# Altium project LimeSDR-X3_1v2.PrjPcb (part 8 of 20)

## Sheet 16_LMS2_RF2_Misc.SchDoc: LMS2 RF2 Misc
size A3; Organization: Lime Microsystems; Address1: Surrey Tech Centre; Address2: Guildford GU2 7YG; Address3: Surrey; Address4: United Kingdom; Revision: 1.2; SheetNumber: 16; SheetTotal: 31
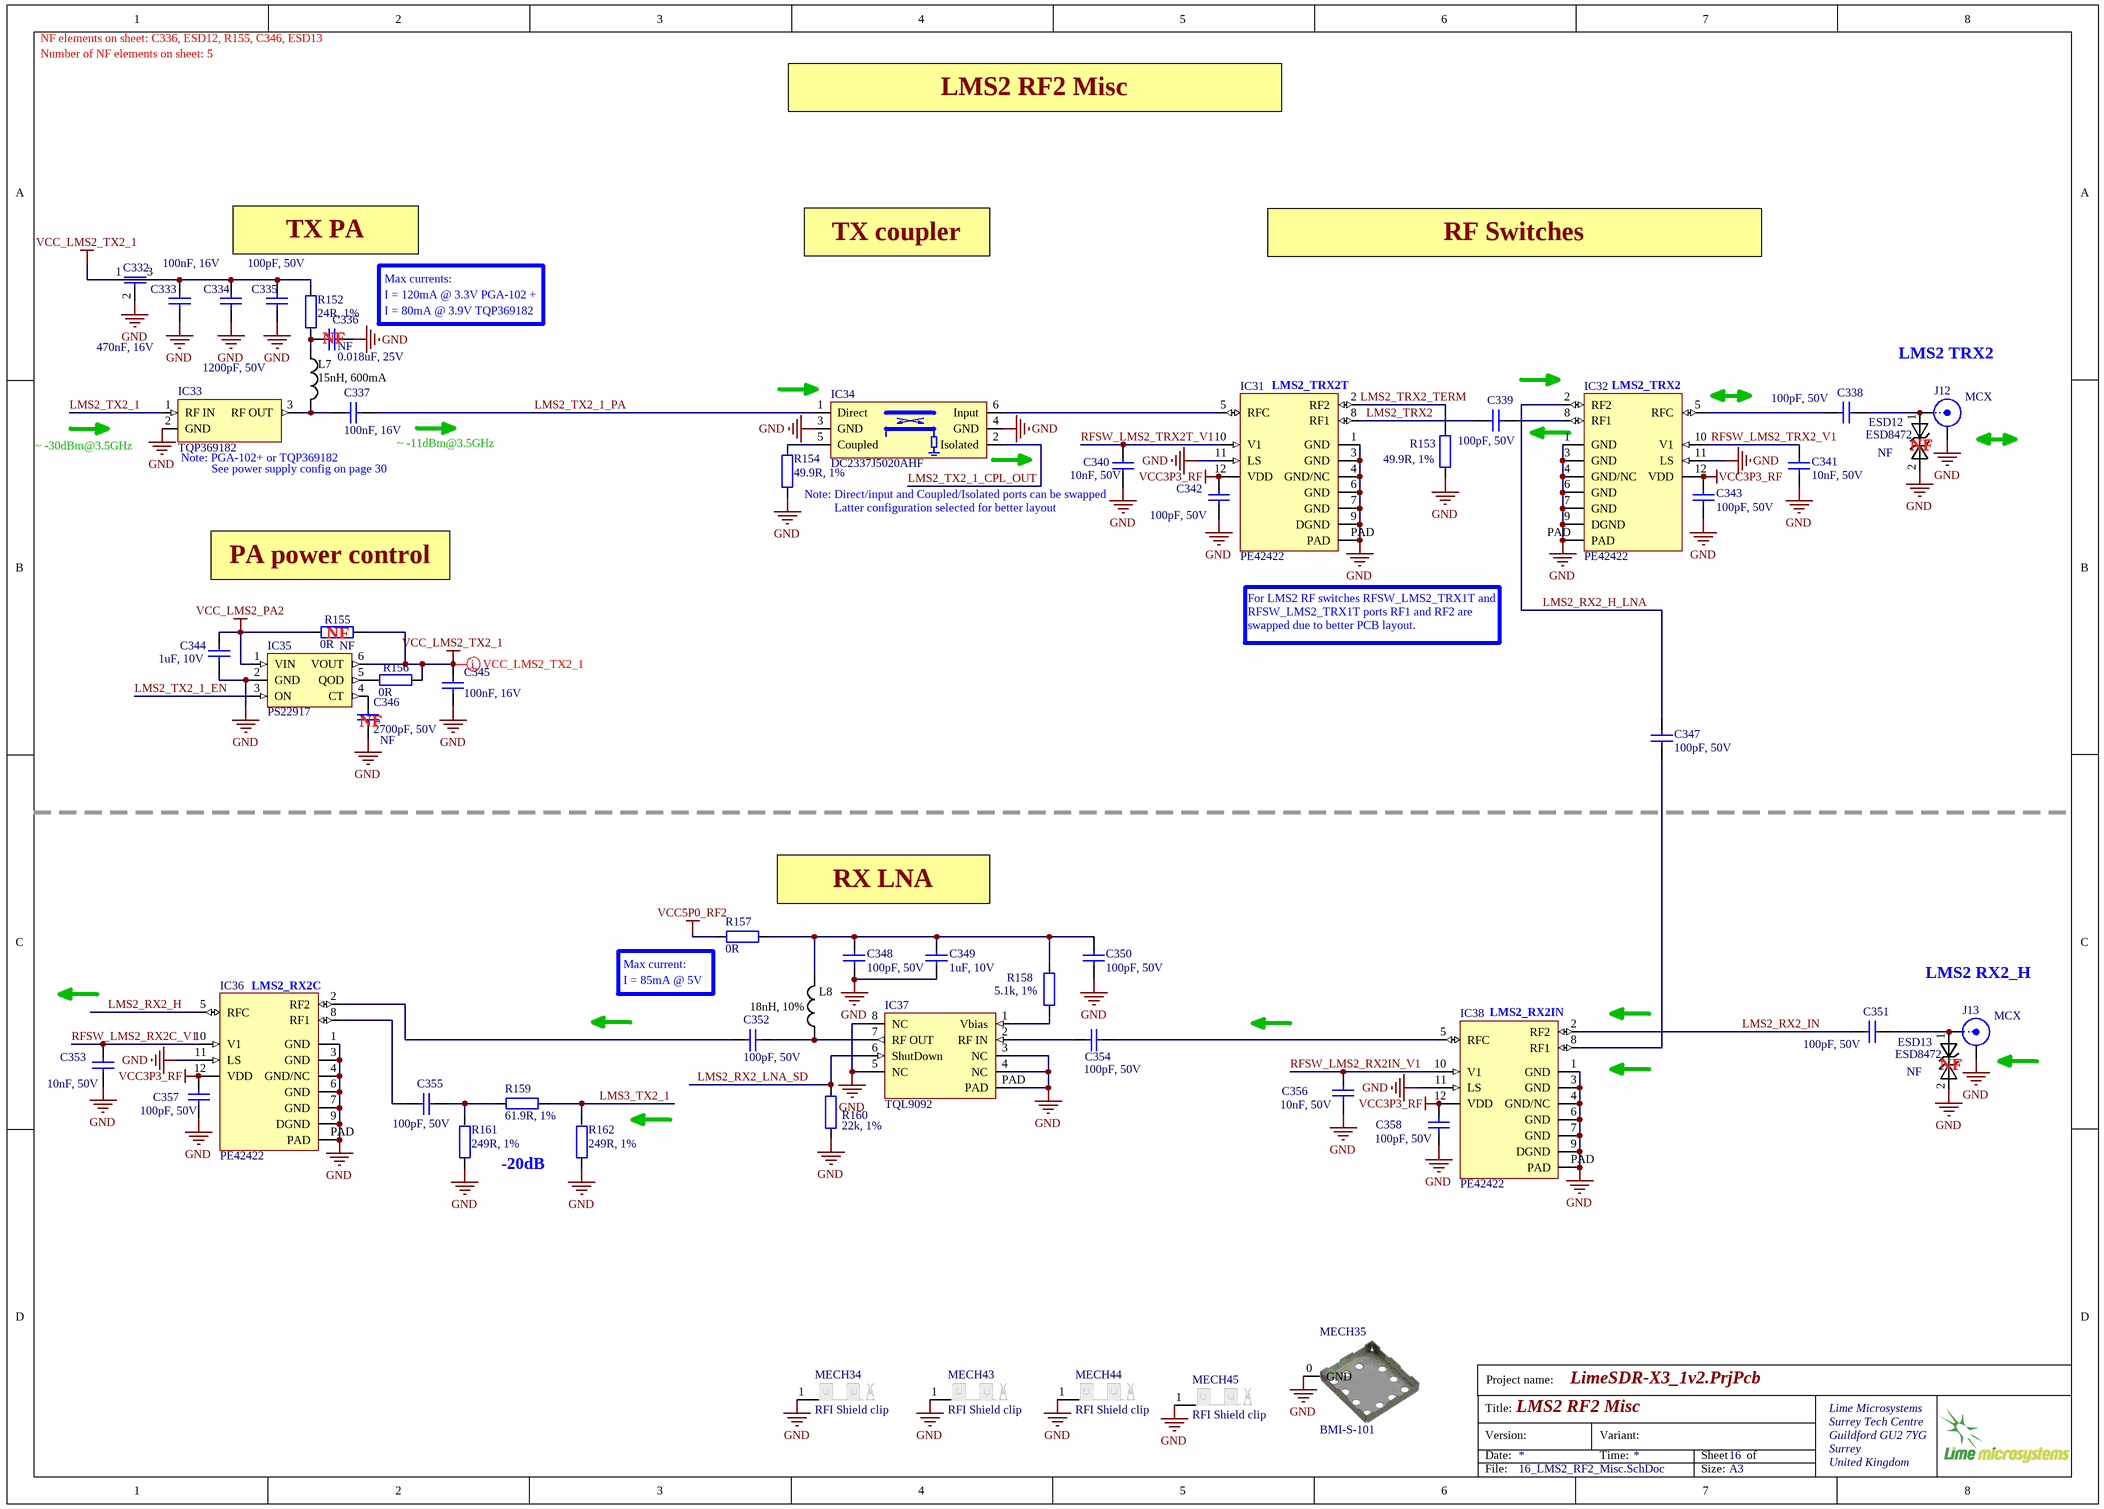
[diagram p15: 16_LMS2_RF2_Misc.SchDoc]

### Parts
C332  470nF, 16V  [CAP0805_FEEDTHROUGH]
C333  100nF, 16V  [CAP0402]
C334  1200pF, 50V  [CAP0402]
C335  100pF, 50V  [CAP0402]
C336  0.018uF, 25V  Assembly Info: NF  [CAP0402]
C337  100nF, 16V  [CAP0402]
C338  100pF, 50V  [CAP0402]
C339  100pF, 50V  [CAP0402]
C340  10nF, 50V  [CAP0402]
C341  10nF, 50V  [CAP0402]
C342  100pF, 50V  [CAP0402]
C343  100pF, 50V  [CAP0402]
C344  1uF, 10V  [CAP0402]
C345  100nF, 16V  [CAP0402]
C346  2700pF, 50V  Assembly Info: NF  [CAP0402]
C347  100pF, 50V  [CAP0402]
C348  100pF, 50V  [CAP0402]
C349  1uF, 10V  [CAP0402]
C350  100pF, 50V  [CAP0402]
C351  100pF, 50V  [CAP0402]
C352  100pF, 50V  [CAP0402]
C353  10nF, 50V  [CAP0402]
C354  100pF, 50V  [CAP0402]
C355  100pF, 50V  [CAP0402]
C356  10nF, 50V  [CAP0402]
C357  100pF, 50V  [CAP0402]
C358  100pF, 50V  [CAP0402]
ESD12  ESD8472  Assembly Info: NF  [ESD8472_X3DFN2]
ESD13  ESD8472  Assembly Info: NF  [ESD8472_X3DFN2]
IC31  PE42422  [PE42422_QFN12]
IC32  PE42422  [PE42422_QFN12]
IC33  TQP369182  [PGA-102+_SOT89]
IC34  DC2337J5020AHF  [DC2337J5020AHF_ANAREN_COUPLER_0805]
IC35  PS22917  [SOT23-6]
IC36  PE42422  [PE42422_QFN12]
IC37  TQL9092  [TQL9092]
IC38  PE42422  [PE42422_QFN12]
J12  MCX  [MCX_connector_vertical_SM]
J13  MCX  [MCX_connector_vertical_SM]
L7  15nH, 600mA  [RES0805]
L8  18nH, 10%  [RES0603]
MECH34  RFI Shield clip  [RFI_SHIELD_CLPS_MINI]
MECH35  BMI-S-101  [BMI-S-101_RF_SHIELD_v2]
MECH43  RFI Shield clip  [RFI_SHIELD_CLPS_MINI]
MECH44  RFI Shield clip  [RFI_SHIELD_CLPS_MINI]
MECH45  RFI Shield clip  [RFI_SHIELD_CLPS_MINI]
R152  24R, 1%  [RES0402]
R153  49.9R, 1%  [RES0402]
R154  49.9R, 1%  [RES0402]
R155  0R  Assembly Info: NF  [RES0402]
R156  0R  [RES0402]
R157  0R  [RES0402]
R158  5.1k, 1%  [RES0603]
R159  61.9R, 1%  [RES0402]
R160  22k, 1%  [RES0402]
R161  249R, 1%  [RES0402]
R162  249R, 1%  [RES0402]

### Nets
GND: C332.2 C333.1 C334.2 C335.2 C336.2 C340.2 C341.2 C342.1 C343.1 C344.1 C345.1 C346.2 C348.2 C349.1 C350.2 C353.2 C356.2 C357.1 C358.1 ESD12.2 ESD13.2 IC31.1(GND) IC31.3(GND) IC31.4(GND/NC) IC31.6(GND) IC31.7(GND) IC31.9(DGND) IC31.11(LS) IC31.PAD IC32.1(GND) IC32.3(GND) IC32.4(GND/NC) IC32.6(GND) IC32.7(GND) IC32.9(DGND) IC32.11(LS) IC32.PAD IC33.2(GND) IC34.3(GND) IC34.4(GND) IC35.2(GND) IC36.1(GND) IC36.3(GND) IC36.4(GND/NC) IC36.6(GND) IC36.7(GND) IC36.9(DGND) IC36.11(LS) IC36.PAD IC37.3(NC) IC37.4(NC) IC37.5(NC) IC37.8(NC) IC37.PAD IC38.1(GND) IC38.3(GND) IC38.4(GND/NC) IC38.6(GND) IC38.7(GND) IC38.9(DGND) IC38.11(LS) IC38.PAD J12.2(Y) J13.2(Y) MECH34.1(GND) MECH35.0(GND) MECH43.1(GND) MECH44.1(GND) MECH45.1(GND) R153.2 R154.2 R160.1 R161.1 R162.1
VCC3P3_RF: C342.2 C343.2 C357.2 C358.2 IC31.12(VDD) IC32.12(VDD) IC36.12(VDD) IC38.12(VDD)
VCC5P0_RF2: R157.1
VCC_LMS2_PA2: C344.2 IC35.1(VIN) R155.2
VCC_LMS2_TX2_1: C332.1 C345.2 IC35.6(VOUT) R155.1 R156.1
LMS2_RX2_H: IC36.5(RFC)
LMS2_RX2_H_LNA: C347.2 IC32.2(RF2)
LMS2_RX2_IN: C351.1 IC38.2(RF2)
LMS2_RX2_LNA_SD: IC37.6(ShutDown) R160.2
LMS2_TRX2: C339.1 IC31.8(RF1)
LMS2_TRX2_TERM: IC31.2(RF2) R153.1
LMS2_TX2_1: IC33.1(RF_IN)
LMS2_TX2_1_CPL_OUT: IC34.2(Isolated)
LMS2_TX2_1_EN: IC35.3(ON)
LMS2_TX2_1_PA: C337.1 IC34.1(Direct)
LMS3_TX2_1: R159.2 R162.2
RFSW_LMS2_RX2C_V1: C353.1 IC36.10(V1)
RFSW_LMS2_RX2IN_V1: C356.1 IC38.10(V1)
RFSW_LMS2_TRX2_V1: C341.1 IC32.10(V1)
RFSW_LMS2_TRX2T_V1: C340.1 IC31.10(V1)
NetC332_3: C332.3 C333.2 C334.1 C335.1 R152.1
NetC336_1: C336.1 L7.1 R152.2
NetC337_2: C337.2 IC33.3(RF_OUT) L7.2
NetC338_1: C338.1 IC32.5(RFC)
NetC338_2: C338.2 ESD12.1 J12.1(X)
NetC339_2: C339.2 IC32.8(RF1)
NetC346_1: C346.1 IC35.4(CT)
NetC347_1: C347.1 IC38.8(RF1)
NetC348_1: C348.1 C349.2 C350.1 L8.1 R157.2 R158.2
NetC351_2: C351.2 ESD13.1 J13.1(X)
NetC352_1: C352.1 IC36.2(RF2)
NetC352_2: C352.2 IC37.7(RF_OUT) L8.2
NetC354_1: C354.1 IC37.2(RF_IN)
NetC354_2: C354.2 IC38.5(RFC)
NetC355_1: C355.1 R159.1 R161.2
NetC355_2: C355.2 IC36.8(RF1)
NetIC31_5: IC31.5(RFC) IC34.6(Input)
NetIC34_5: IC34.5(Coupled) R154.1
NetIC35_5: IC35.5(QOD) R156.2
NetIC37_1: IC37.1(Vbias) R158.1

### Layout directives
net class VCC_LMS2_TX2_2: VCC_LMS2_TX2_1

### Notes on the sheet
- NF elements on sheet: C336, ESD12, R155, C346, ESD13
- Number of NF elements on sheet: 5
- LMS2 RF2 Misc
- TX PA
- (near C332) Ch2
- I = 120mA @ 3.3V PGA-102 +
- Max currents:
- I = 80mA @ 3.9V TQP369182
- TX coupler
- RF Switches
- NF
- LMS2 TRX2
- (near IC33) ~ -30dBm@3.5GHz
- (near C337) ~ -11dBm@3.5GHz
- (near IC31) LMS2_TRX2T
- (near IC32) LMS2_TRX2
- (near ESD12) NF
- (near IC33) Note: PGA-102+ or TQP369182
- See power supply config on page 30
- Note: Direct/input and Coupled/Isolated ports can be swapped
- (near C340) Latter configuration selected for better layout
- PA power control
- (near R155) NF
- (near IC31) For LMS2 RF switches RFSW_LMS2_TRX1T and RFSW_LMS2_TRX1T ports RF1 and RF2 are swapped due to better PCB layout.
- (near C346) NF
- RX LNA
- (near IC36) LMS2_RX2C
- I = 85mA @ 5V
- (near R157) Max current:
- LMS2 RX2_H
- (near IC38) LMS2_RX2IN
- (near ESD13) NF
- -20dB
- Project name:
- Title:
- Version:
- Date:
- Variant:
- Time:
- Sheet
- of
- File:
- Size:
- A3

### Library data of the parts
C332 = Cap_feed_through: as C262 on sheet 14_LMS1_RF_PA; Value: 470nF, 16V; Supplier 1: Digi-Key; Supplier Part Number 1: 490-2537-1-ND; Stock 1: 220606; Pricing 1: 1=0,25000, 10=0,22900, 25=0,21840, 50=0,21160, 100=0,20450, 250=0,19392, 500=0,16218, 1000=0,12586 (USD); Mount: Surface Mount,PCB; Case/Package: 0805; Weight: 0.000194oz; Case Code (Metric): 2012; Case Code (Imperial): 0805; Min Operating Temperature: -55°C; Max Operating Temperature: 125°C; Package Quantity: 1; Capacitance: 470nF; Packaging: Tape and Reel; Max Voltage Rating (DC): 16V; Current Rating: 2A; Voltage Rating: 16V; Voltage Rating (DC): 16V; Voltage: 16V; Current: 2A; Termination: Flat; Length: 2mm; Height: 0.85mm; Width: 1.25mm; Depth: 1.25mm; Radiation Hardening: No; REACH SVHC: No SVHC; Lead Free: Lead Free; RoHS: Yes
C333 C337 C345 = Cap_0402: as C263 on sheet 14_LMS1_RF_PA; Value: 100nF, 16V; Supplier 1: Mouser; Supplier Part Number 1: 81-GRM155R71C104KA88; Case Code - in: 0402; RoHS: RoHS Compliant; Operating Temperature Range: - 55 C to + 125 C; Series: GRM; Termination Style: SMD/SMT; Package / Case: 0402 (1005 metric); Voltage Rating DC: 16 V; Maximum Operating Temperature: + 125 C; Case Code - mm: 1005; Minimum Operating Temperature: - 55 C; Product Category: Low & Medium Capacitance SMD Ceramic Chip Capacitors; Packaging: Reel; Product: General Type MLCCs; Category: Multilayer Ceramic Capacitors MLCC - SMD/SMT; Brand: Murata Electronics; Case Width: 0.5 mm; RoHS - Mouser: Y; Standard Pack Qty: 10000; Minimum Order Quantity: 1; Reeling: True
C334 = Cap_0402: as C306 on sheet 15_LMS2_RF1_Misc; Value: 1200pF, 50V; Supplier 1: Digi-Key; Supplier Part Number 1: 399-7334-1-ND; Thickness (Max): 0.022" (0.55mm); Capacitance: 1200pF; Lead Spacing: -; Mounting Type: Surface Mount, MLCC; Package / Case: 0402 (1005 Metric); Category: Capacitors; Size / Dimension: 0.039" L x 0.020" W (1.00mm x 0.50mm); Voltage - Rated: 50V; Lead Style: -; Ratings: -; Features: -; Packaging: Cut Tape (CT); RoHS: RoHS Compliant; Operating Temperature: -55°C ~ 125°C; Applications: General Purpose; Height - Seated (Max): -
C335 C338 C339 C342 C343 C347 C348 C350-C352 C354 C355 C357 C358 = Cap_0402: as C268 on sheet 14_LMS1_RF_PA; Value: 100pF, 50V; Capacitance: 100pF; Thickness (Max): 0.022" (0.55mm); Size / Dimension: 0.039" L x 0.020" W (1.00mm x 0.50mm); RoHS: RoHS Compliant; Ratings: -; Package / Case: 0402 (1005 Metric); Mounting Type: Surface Mount, MLCC; Height - Seated (Max): -; Features: -; Lead Spacing: -; Voltage - Rated: 50V; Operating Temperature: -55°C ~ 125°C; Packaging: Cut Tape (CT); Applications: General Purpose; Lead Style: -; Supplier 1: Digi-Key; Category: Capacitors; Supplier Part Number 1: 311-1024-1-ND
C336 = Cap_0402: as C309 on sheet 15_LMS2_RF1_Misc; Value: 0.018uF, 25V; ComponentLink1URL: http://www.murata.com/~/media/webrenewal/support/library/catalog/products/capacitor/mlcc/c02e.ashx?la=en-us; ComponentLink1Description: http://www.murata.com/~/media/webrenewal/support/library/catalog/products/capacitor/mlcc/c02e.ashx?la=en-us; Supplier 1: Digi-Key; Supplier Part Number 1: 311-3345-1-ND; Stock 1: 39602; Pricing 1: 1=0,10000, 10=0,05000, 100=0,02210, 500=0,01580, 1000=0,01242, 2500=0,01129, 5000=0,01038 (USD); RoHS: Yes; Mount: Surface Mount; Case/Package: 0402; Min Operating Temperature: -55°C; Max Operating Temperature: 125°C; Packaging: Tape and Reel; Voltage Rating: 25V; Voltage Rating (DC): 25V; Length: 0.039inch; Width: 0.02inch; Thickness: 0.022inch; Lead Free: Lead Free; Halogen Free: Halogen Free; ComponentLink2URL: http://www.yageo.com/documents/recent/UPY-GPHC_X7R_6.3V-to-50V_18.pdf?src-supplier=Digi-Key; ComponentLink2Description: http://www.yageo.com/documents/recent/UPY-GPHC_X7R_6.3V-to-50V_18.pdf?src-supplier=Digi-Key; ComponentLink3URL: http://www.yageo.com/documents/recent/UPY-GPHC_X7R_6.3V-to-50V_16.pdf?src-supplier=Digi-Key; ComponentLink3Description: http://www.yageo.com/documents/recent/UPY-GPHC_X7R_6.3V-to-50V_16.pdf?src-supplier=Digi-Key
C340 C341 C353 C356 = Cap_0402: as C273 on sheet 14_LMS1_RF_PA; Value: 10nF, 50V; Supplier 1: Digi-Key; Supplier Part Number 1: 490-4516-2-ND; RoHS: RoHS Compliant; Category: Capacitors; Stock 1: 10970000; Pricing 1: 10000=0.00185, 20000=0.00176, 30000=0.00167 (USD); Packaging: Tape & Reel (TR); Part Status: Active; Voltage - Rated: 50V; Operating Temperature: -55°C ~ 125°C; Features: -; Ratings: -; Applications: General Purpose; Mounting Type: Surface Mount, MLCC; Package / Case: 0402 (1005 Metric); Size / Dimension: 0.039" L x 0.020" W (1.00mm x 0.50mm); Height - Seated (Max): -; Thickness (Max): 0.022" (0.55mm); Lead Spacing: -; Lead Style: -; ComponentLink1URL: http://www.murata.com/~/media/webrenewal/support/library/catalog/products/capacitor/mlcc/c02e.ashx?la=en-us; ComponentLink1Description: http://www.murata.com/~/media/webrenewal/support/library/catalog/products/capacitor/mlcc/c02e.ashx?la=en-us
C344 C349 = Cap_0402: as C259-C261 on sheet 14_LMS1_RF_PA; Value: 1uF, 10V; Supplier 1: Digi-Key; Supplier Part Number 1: 445-9066-1-ND; MSL: -; RoHS: YES
C346 = Cap_0402: as C267 on sheet 14_LMS1_RF_PA; Value: 2700pF, 50V; Size / Dimension: 0.039" L x 0.020" W (1.00mm x 0.50mm); Supplier 1: Digi-Key; Height - Seated (Max): -; Package / Case: 0402 (1005 Metric); Supplier Part Number 1: 490-6361-1-ND; Part Status: Active; RoHS: RoHS Compliant; Operating Temperature: -55°C ~ 125°C; Category: Capacitors; Ratings: -; Features: -; Packaging: Cut Tape (CT); Mounting Type: Surface Mount, MLCC; Voltage - Rated: 50V; Lead Spacing: -; Thickness (Max): 0.022" (0.55mm); Applications: General Purpose
ESD12 ESD13 = ESD8472: as ESD8 on sheet 14_LMS1_RF_PA; Supplier 1: Digi-Key; RoHS: RoHS Compliant; Category: Circuit Protection; Stock 1: 2295; Pricing 1: 1=0.39, 10=0.315, 100=0.2142, 500=0.16068, 1000=0.12051 (USD); Packaging: Cut Tape (CT); Part Status: Active; Type: Zener; Power - Peak Pulse: -; Applications: Automotive, RF Antenna; Operating Temperature: -55°C ~ 150°C (TJ); Mounting Type: Surface Mount; Package / Case: 2-XFDFN; Supplier Device Package: 2-X3DFN (0.62x0.32); ComponentLink1URL: http://www.onsemi.com/pub/Collateral/ESD8472-D.PDF; ComponentLink1Description: http://www.onsemi.com/pub/Collateral/ESD8472-D.PDF; Supplier Part Number 1: ESD8472MUT5GOSCT-ND
IC31 IC32 IC36 IC38 = PE42422: as IC23 on sheet 15_LMS2_RF1_Misc; Supplier 1: Digi-Key; RoHS: RoHS Compliant; Category: RF/IF and RFID; Stock 1: 21993; Pricing 1: 1=1.32, 101=0.92 (USD); Packaging: Cut Tape (CT); Part Status: Active; P1dB: -; Features: -; Operating Temperature: -40°C ~ 85°C; Package / Case: 12-UFQFN Exposed Pad; Supplier Device Package: 12-QFN (2x2); ComponentLink1URL: http://www.psemi.com/pdf/datasheets/pe42422ds.pdf; ComponentLink1Description: http://www.psemi.com/pdf/datasheets/pe42422ds.pdf; Supplier Part Number 1: 1046-1062-1-ND
IC33 = PGA-102+_PA: as IC25 on sheet 15_LMS2_RF1_Misc; Manufacturer Part Number 1: TQP369182; Supplier Part Number 1: 772-TQP369182; Supplier 1: Mouser
IC34 = DC2337J5020AHF_coupler: as IC26 on sheet 15_LMS2_RF1_Misc; Supplier Part Number 1: 1173-1090-2-ND; Manufacturer Part Number 1: DC2337J5020AHF; Supplier 1: Digi-Key
IC35 = TPS22918: Part Description: Power Switch/Driver 1:1 P-Channel 2A SOT-23-6; Manufacturer: Texas Instruments; Manufacturer Part Number 1: TPS22917DBVR; Number of Channels: 1; Interface: On/Off; Fault Protection: Reverse Current; Output Configuration: High Side; Max Output Current: 2A; ComponentLink1URL: http://www.ti.com/lit/ds/symlink/tps22918.pdf; ComponentLink1Description: http://www.ti.com/lit/ds/symlink/tps22918.pdf; Supplier 1: Digi-Key; Supplier Part Number 1: 296-50498-1-ND; Stock 1: 29778; Pricing 1: 1=0,64, 10=0,545, 25=0,5084, 100=0,4066, 250=0,3776, 500=0,3195, 1000=0,24689 (USD); RoHS: Yes; Case/Package: SOT-23-6; Min Operating Temperature: -40°C; Max Operating Temperature: 125°C; Packaging: Cut Tape; Number of Outputs: 1; Series: -; RoHS Compliant: Yes; ComponentLink2URL: http://www.ti.com/lit/ds/symlink/tps22917.pdf?src-supplier=Digi-Key; ComponentLink2Description: http://www.ti.com/lit/ds/symlink/tps22917.pdf?src-supplier=Digi-Key
IC37 = TQL9092: as IC29 on sheet 15_LMS2_RF1_Misc; Manufacturer Part Number 1: TQL9092; Supplier 1: Mouser; Supplier Part Number 1: 772-TQL9092
J12 J13 = RF_IF_connector: as J8 on sheet 14_LMS1_RF_PA; ComponentLink1URL: https://datasheet.ciiva.com/5177/c908-22101t-37976-5177328.pdf?src-supplier=Mouser; ComponentLink1Description: https://datasheet.ciiva.com/5177/c908-22101t-37976-5177328.pdf?src-supplier=Mouser; ComponentLink2URL: https://datasheet.ciiva.com/643/c908-22101t-643558.pdf?src-supplier=Digi-Key; ComponentLink2Description: https://datasheet.ciiva.com/643/c908-22101t-643558.pdf?src-supplier=Digi-Key; ComponentLink3URL: https://datasheet.ciiva.com/7662/1636995-7662651.pdf?src-supplier=Element14; ComponentLink3Description: https://datasheet.ciiva.com/7662/1636995-7662651.pdf?src-supplier=Element14; ComponentLink4URL: https://datasheet.ciiva.com/5689/c908-22101t-5689787.pdf?src-supplier=Farnell; ComponentLink4Description: https://datasheet.ciiva.com/5689/c908-22101t-5689787.pdf?src-supplier=Farnell; ComponentLink5URL: https://datasheet.ciiva.com/7996/691284-7996807.pdf?src-supplier=Element14; ComponentLink5Description: https://datasheet.ciiva.com/7996/691284-7996807.pdf?src-supplier=Element14; ComponentLink6URL: https://datasheet.ciiva.com/643/c908-22101t-643559.pdf?src-supplier=Digi-Key; ComponentLink6Description: https://datasheet.ciiva.com/643/c908-22101t-643559.pdf?src-supplier=Digi-Key; ComponentLink7URL: https://datasheet.ciiva.com/643/c908-22101t-643560.pdf?src-supplier=Digi-Key; ComponentLink7Description: https://datasheet.ciiva.com/643/c908-22101t-643560.pdf?src-supplier=Digi-Key; Supplier 1: Digikey; Supplier Part Number 1: J548-ND; Stock 1: 6208; Pricing 1: 1=2,86, 10=2,595, 25=2,4576, 50=2,4006, 100=2,2862, 250=2,01248 (USD); RoHS: Yes; Housing Material: 152ConductorMaterial; ComponentLink8URL: https://datasheet.ciiva.com/643/dr-1333711201-643313.pdf?src-supplier=Digikey; ComponentLink8Description: https://datasheet.ciiva.com/643/dr-1333711201-643313.pdf?src-supplier=Digikey; ComponentLink9URL: https://datasheet.ciiva.com/3131/pi-133-3711-201-3131233.pdf?src-supplier=Avnet; ComponentLink9Description: https://datasheet.ciiva.com/3131/pi-133-3711-201-3131233.pdf?src-supplier=Avnet; ComponentLink10URL: https://datasheet.ciiva.com/23817/1720439-23817678.pdf?src-supplier=Newark; ComponentLink10Description: https://datasheet.ciiva.com/23817/1720439-23817678.pdf?src-supplier=Newark; ComponentLink11URL: https://datasheet.ciiva.com/23769/249599-23769434.pdf?src-supplier=Newark; ComponentLink11Description: https://datasheet.ciiva.com/23769/249599-23769434.pdf?src-supplier=Newark; ComponentLink12URL: https://datasheet.ciiva.com/22686/1720437-22686743.pdf?src-supplier=Element14; ComponentLink12Description: https://datasheet.ciiva.com/22686/1720437-22686743.pdf?src-supplier=Element14
L7 = Inductor_0603: as L5 on sheet 15_LMS2_RF1_Misc; Value: 15nH, 600mA; Supplier 1: Digi-Key; Supplier Part Number 1: CW201212-15NJDKR-ND; Stock 1: 2733; Pricing 1: 1=0.37, 10=0.327, 100=0.2245, 500=0.19188, 1000=0.14697 (USD); Mount: Surface Mount; Case/Package: 0805; Weight: 0.000194oz; Case Code (Metric): 2012; Case Code (Imperial): 0805; Min Operating Temperature: -40°C; Max Operating Temperature: 125°C; Package Quantity: 2000; Packaging: Tape and Reel; Current Rating: 600mA; Inductance: 15nH; Max DC Current: 600mA; Termination: SMD/SMT; Composition: Wirewound,Ceramic; DC Current: 600mA; Military Standard: Not; Length: 0.083inch; Height: 0.051inch; Width: 1.5mm; Height - Seated (Max): 0.059inch; Depth: 1.7mm; Radiation Hardening: No; ComponentLink1URL: http://www.bourns.com/data/global/PDFs/CW201212.pdf?src-supplier=Avnet+Europe; ComponentLink1Description: http://www.bourns.com/data/global/PDFs/CW201212.pdf?src-supplier=Avnet+Europe; ComponentLink2URL: http://www.bourns.com/data/global/pdfs/CW201212.pdf?src-supplier=Digi-Key; ComponentLink2Description: http://www.bourns.com/data/global/pdfs/CW201212.pdf?src-supplier=Digi-Key; ComponentLink3URL: http://www.bourns.com/data/global/PDFs/CW201212.pdf?src-supplier=Avnet; ComponentLink3Description: http://www.bourns.com/data/global/PDFs/CW201212.pdf?src-supplier=Avnet; ComponentLink4URL: http://www.onlinecomponents.com/productFiles/mf-BO/cw201212.pdf?src-supplier=Onlinecomponents.com; ComponentLink4Description: http://www.onlinecomponents.com/productFiles/mf-BO/cw201212.pdf?src-supplier=Onlinecomponents.com
L8 = Inductor: as L6 on sheet 15_LMS2_RF1_Misc; Value: 18nH, 10%; Supplier 1: Digi-Key; Supplier Part Number 1: 1840-1105-1-ND; RoHS: RoHS Compliant; Category: Inductors, Coils, Chokes; Stock 1: 14000; Pricing 1: 1=0.41, 10=0.368, 100=0.253, 500=0.2162, 1000=0.1656 (USD); Packaging: Cut Tape (CT); Part Status: Active; Tolerance: ±10%; Ratings: -; Operating Temperature: -40°C ~ 125°C; Mounting Type: Surface Mount; Package / Case: 0603 (1608 Metric); Supplier Device Package: 0603 (1608 Metric); Size / Dimension: 0.071" L x 0.049" W (1.80mm x 1.24mm); Height - Seated (Max): 0.040" (1.02mm); ComponentLink1URL: http://productfinder.pulseeng.com/products/datasheets/WC701.pdf; ComponentLink1Description: http://productfinder.pulseeng.com/products/datasheets/WC701.pdf
MECH34 MECH43-MECH45 = RFI_SHIELD_CLIP: Manufacturer Part Number 1: S0971-46R; Manufacturer: HARWIN; Part Description: RFI SHIELD CLIP MINI TIN SMD; SVHC: No SVHC (15-Jun-2015); Supplier 1: Farnell; Supplier: Farnell; Length: 5.8; Clip Type: RFI Shield Clip; Clip Diameter: -; Product Range: -; Mounting Hole Dia: -; RoHS: YES; Supplier Part Number 1: 2361677
MECH35 = BMI-S-101_RF_SHIELD: Part Description: RF Shield Shield, 1-Piece 0.512" (13.00mm) X 0.538" (13.66mm) Vent Holes in Pattern Surface Mount; Manufacturer: Laird; ComponentLink1URL: http://assets.lairdtech.com/home/brandworld/files/EMI-CAT-Essentials%201213.pdf?src-supplier=Digikey; ComponentLink1Description: http://assets.lairdtech.com/home/brandworld/files/EMI-CAT-Essentials%201213.pdf?src-supplier=Digikey; ComponentLink2URL: http://assets.lairdtech.com/home/brandworld/files/Board%20Level%20Shields%20Catalog%20Download.pdf?src-supplier=Digikey; ComponentLink2Description: http://assets.lairdtech.com/home/brandworld/files/Board%20Level%20Shields%20Catalog%20Download.pdf?src-supplier=Digikey; ComponentLink3URL: https://datasheet.octopart.com/BMI-S-101-Laird-datasheet-150754577.pdf?src-supplier=Sager+Electronics; ComponentLink3Description: https://datasheet.octopart.com/BMI-S-101-Laird-datasheet-150754577.pdf?src-supplier=Sager+Electronics; Supplier 1: Digikey; Supplier Part Number 1: 903-1006-1-ND; Manufacturer Part Number 1: BMI-S-101; Stock 1: 1005; Pricing 1: 1=2,45, 10=1,535, 25=1,2968, 100=1,0281, 250=0,89596, 500=0,8147 (USD); RoHS: Yes
R152 = Res_0402: as R141 on sheet 15_LMS2_RF1_Misc; Value: 24R, 1%; Supplier 1: Digi-Key; Supplier Part Number 1: 13-AC0402FR-0724RLCT-ND; Stock 1: 14420; Pricing 1: 1=0.1, 10=0.022, 100=0.009, 1000=0.00402, 2500=0.00349, 5000=0.00288 (USD); Case/Package: 0402; Min Operating Temperature: -55°C; Max Operating Temperature: 155°C; Packaging: Tape and Reel; Resistance: 24R; Resistor Type: Thick Film; Number of Terminations: 2; Tolerance: 1%; Features: Moisture Resistant,Automotive AEC-Q200; Length: 0.039inch; Width: 0.02inch; Height: 0.015inch; RoHS Compliant: Yes; ComponentLink1URL: http://www.yageo.com/NewPortal/yageodocoutput?fileName=/pdf/R-Chip/PYu-AC_51_RoHS_L_6.pdf&src-supplier=Digi-Key; ComponentLink1Description: http://www.yageo.com/NewPortal/yageodocoutput?fileName=/pdf/R-Chip/PYu-AC_51_RoHS_L_6.pdf&src-supplier=Digi-Key
R153 R154 = Res_0402: as R142 on sheet 15_LMS2_RF1_Misc; Number of Terminations: 2; Size / Dimension: 0.039" L x 0.020" W (1.00mm x 0.50mm); Supplier Device Package: 0402 (1005 Metric); RoHS: RoHS Compliant; Supplier Part Number 1: 1276-3469-6-ND; Features: -; Packaging: Digi-Reel®; Tolerance: ±1%; Height: 0.016" (0.40mm); Category: Resistors; Composition: Thick Film; Package / Case: 0402 (1005 Metric); Supplier 1: Digi-Key; Operating Temperature: -55°C ~ 155°C; Value: 49.9R, 1%; Manufacturer Part Number 1: RC1005F49R9CS
R155-R157 = Res_0402: as R113 on sheet 14_LMS1_RF_PA; Value: 0R; Supplier 1: Digi-Key; Supplier Part Number 1: 311-0.0JRTR-ND; Category: Resistors; Temperature Coefficient: -; Features: Moisture Resistant; Supplier Device Package: 0402; Height: 0.016" (0.40mm); Package / Case: 0402 (1005 Metric); Operating Temperature: -55°C ~ 155°C; Size / Dimension: 0.039" L x 0.020" W (1.00mm x 0.50mm); Composition: Thick Film; Packaging: Tape & Reel (TR); Number of Terminations: 2; RoHS: RoHS Compliant
R158 = Res_0603: as R147 on sheet 15_LMS2_RF1_Misc; Value: 5.1k, 1%; ComponentLink1URL: https://industrial.panasonic.com/cdbs/www-data/pdf/RDA0000/AOA0000C304.pdf; ComponentLink1Description: https://industrial.panasonic.com/cdbs/www-data/pdf/RDA0000/AOA0000C304.pdf; Supplier 1: Digi-Key; Supplier Part Number 1: RMCF0603FT5K10CT-ND; Stock 1: 1507174; Pricing 1: 1=0,10000, 10=0,01500, 100=0,00610, 1000=0,00273, 2500=0,00237 (USD); RoHS: Yes; Mount: Surface Mount; Case/Package: 0603; Case Code (Metric): 1608; Case Code (Imperial): 0603; Contact Plating: Tin,Matte; Min Operating Temperature: -55°C; Max Operating Temperature: 155°C; Tolerance: 1%; Packaging: Tape and Reel; Resistor Type: Thick Film; Number of Terminations: 2; Features: Automotive AEC-Q200; Series: RMCF; Length: 0.061inch; Width: 0.031inch; Height: 0.022inch; Radiation Hardening: No; RoHS Compliant: Yes; ComponentLink2URL: http://components.arrow.com/part/dataview/50863347S9465827N1174?src-supplier=Arrow+Electronics; ComponentLink2Description: http://components.arrow.com/part/dataview/50863347S9465827N1174?src-supplier=Arrow+Electronics; ComponentLink3URL: https://www.seielect.com/catalog/SEI-RMCF_RMCP.pdf?src-supplier=Avnet; ComponentLink3Description: https://www.seielect.com/catalog/SEI-RMCF_RMCP.pdf?src-supplier=Avnet; ComponentLink4URL: https://www.seielect.com/catalog/SEI-Packaging.pdf?src-supplier=Digi-Key; ComponentLink4Description: https://www.seielect.com/catalog/SEI-Packaging.pdf?src-supplier=Digi-Key
R159 = Res_0402: Part Description: 61.9 Ohms ±1% 0.063W, 1/16W Chip Resistor 0402 (1005 Metric) Moisture Resistant Thick Film; Manufacturer: Yageo; Manufacturer Part Number 1: RC0402FR-0761R9L; Power Rating: 62.5mW; Voltage Rating: 50V; Temperature Coefficient: 100ppm/°C; Max Power Dissipation: 63mW; Value: 61.9R, 1%; ComponentLink1URL: https://datasheet.ciiva.com/12577/pyu-rc0402-51-rohs-l-6-r-12577388.pdf?src-supplier=Mouser; ComponentLink1Description: https://datasheet.ciiva.com/12577/pyu-rc0402-51-rohs-l-6-r-12577388.pdf?src-supplier=Mouser; ComponentLink2URL: https://datasheet.ciiva.com/17332/pyu-rc0402-51-rohs-l-6-17332587.pdf?src-supplier=Future+Electronics; ComponentLink2Description: https://datasheet.ciiva.com/17332/pyu-rc0402-51-rohs-l-6-17332587.pdf?src-supplier=Future+Electronics; Supplier 1: Digi-Key; Supplier Part Number 1: 311-61.9LRCT-ND; Stock 1: 93771; Pricing 1: 1=0,10000, 10=0,01600, 100=0,00660, 1000=0,00299, 2500=0,00259, 5000=0,00214 (USD); RoHS: Yes; Case/Package: 0402; Case Code (Imperial): 0402; Case Code (Metric): 1005; Contact Plating: Tin,Matte,Lead; Min Operating Temperature: -55°C; Max Operating Temperature: 155°C; Package Quantity: 1; Resistance: 61.9R; Tolerance: 1%; Packaging: Tape and Reel; Termination: SMD/SMT; Resistor Type: Thick Film; Number of Terminations: 2; Voltage Rating (DC): 50V; Working Voltage: 50V; Features: Moisture Resistant; Series: RC; Construction: Rectangular; Technology: THICK FILM; Length: 1mm; Width: 0.5mm; Height: 0.016inch; Depth: 0.5mm; Radiation Hardening: No; Military Standard: Not; Lead Free: Lead Free; RoHS Compliant: Yes; ComponentLink3URL: https://datasheet.ciiva.com/2453/pyu-r-int-thick-7-2453707.pdf?src-supplier=Digi-Key; ComponentLink3Description: https://datasheet.ciiva.com/2453/pyu-r-int-thick-7-2453707.pdf?src-supplier=Digi-Key; ComponentLink4URL: https://datasheet.ciiva.com/2453/pyu-r-int-thick-7-2453708.pdf?src-supplier=Digi-Key; ComponentLink4Description: https://datasheet.ciiva.com/2453/pyu-r-int-thick-7-2453708.pdf?src-supplier=Digi-Key; ComponentLink5URL: https://datasheet.ciiva.com/2453/pyu-r-int-thick-7-2453706.pdf?src-supplier=Digi-Key; ComponentLink5Description: https://datasheet.ciiva.com/2453/pyu-r-int-thick-7-2453706.pdf?src-supplier=Digi-Key; ComponentLink6URL: https://datasheet.ciiva.com/8888/pyu-rc0402-51-rohs-l-6-8888591.pdf?src-supplier=Avnet; ComponentLink6Description: https://datasheet.ciiva.com/8888/pyu-rc0402-51-rohs-l-6-8888591.pdf?src-supplier=Avnet; ComponentLink7URL: https://datasheet.ciiva.com/16741/pyu-rc0402-51-rohs-l-6-r-16741941.pdf?src-supplier=Future+Electronics; ComponentLink7Description: https://datasheet.ciiva.com/16741/pyu-rc0402-51-rohs-l-6-r-16741941.pdf?src-supplier=Future+Electronics; ComponentLink8URL: https://datasheet.ciiva.com/15189/getdatasheetpartid-325045-15189495.pdf?src-supplier=Verical; ComponentLink8Description: https://datasheet.ciiva.com/15189/getdatasheetpartid-325045-15189495.pdf?src-supplier=Verical
R160 = Res_0402: as R149 on sheet 15_LMS2_RF1_Misc; Value: 22k, 1%; Number of Terminations: 2; Operating Temperature: -55°C ~ 155°C; Package / Case: 0402 (1005 Metric); Category: Resistors; Size / Dimension: 0.039" L x 0.020" W (1.00mm x 0.50mm); Height: 0.016" (0.40mm); Supplier 1: Digi-Key; Supplier Part Number 1: 311-22.0KLRCT-ND; RoHS: RoHS Compliant; Features: Moisture Resistant; Packaging: Cut Tape (CT); Composition: Thick Film; Supplier Device Package: 0402; Resistance (Ohms): 22k; Tolerance: ±1%
R161 R162 = Res_0402: as R150 on sheet 15_LMS2_RF1_Misc; Value: 249R, 1%; Category: Resistors; Composition: Thick Film; Features: -; Height: 0.016" (0.40mm); Number of Terminations: 2; Operating Temperature: -55°C ~ 155°C; Package / Case: 0402 (1005 Metric); Packaging: Cut Tape (CT); RoHS: RoHS Compliant; Size / Dimension: 0.039" L x 0.020" W (1.00mm x 0.50mm); Supplier 1: Digi-Key; Supplier Device Package: 0402; Supplier Part Number 1: RMCF0402FT249RCT-ND; Tolerance: ±1%

## Sheet 17_FPGA_B12_B13_B14_B15.SchDoc: FPGA Banks 12, 13, 14, 15
size A3; Organization: Lime Microsystems; Address1: Surrey Tech Centre; Address2: Guildford GU2 7YG; Address3: Surrey; Address4: United Kingdom; Revision: 1.2; SheetNumber: 17; SheetTotal: 31
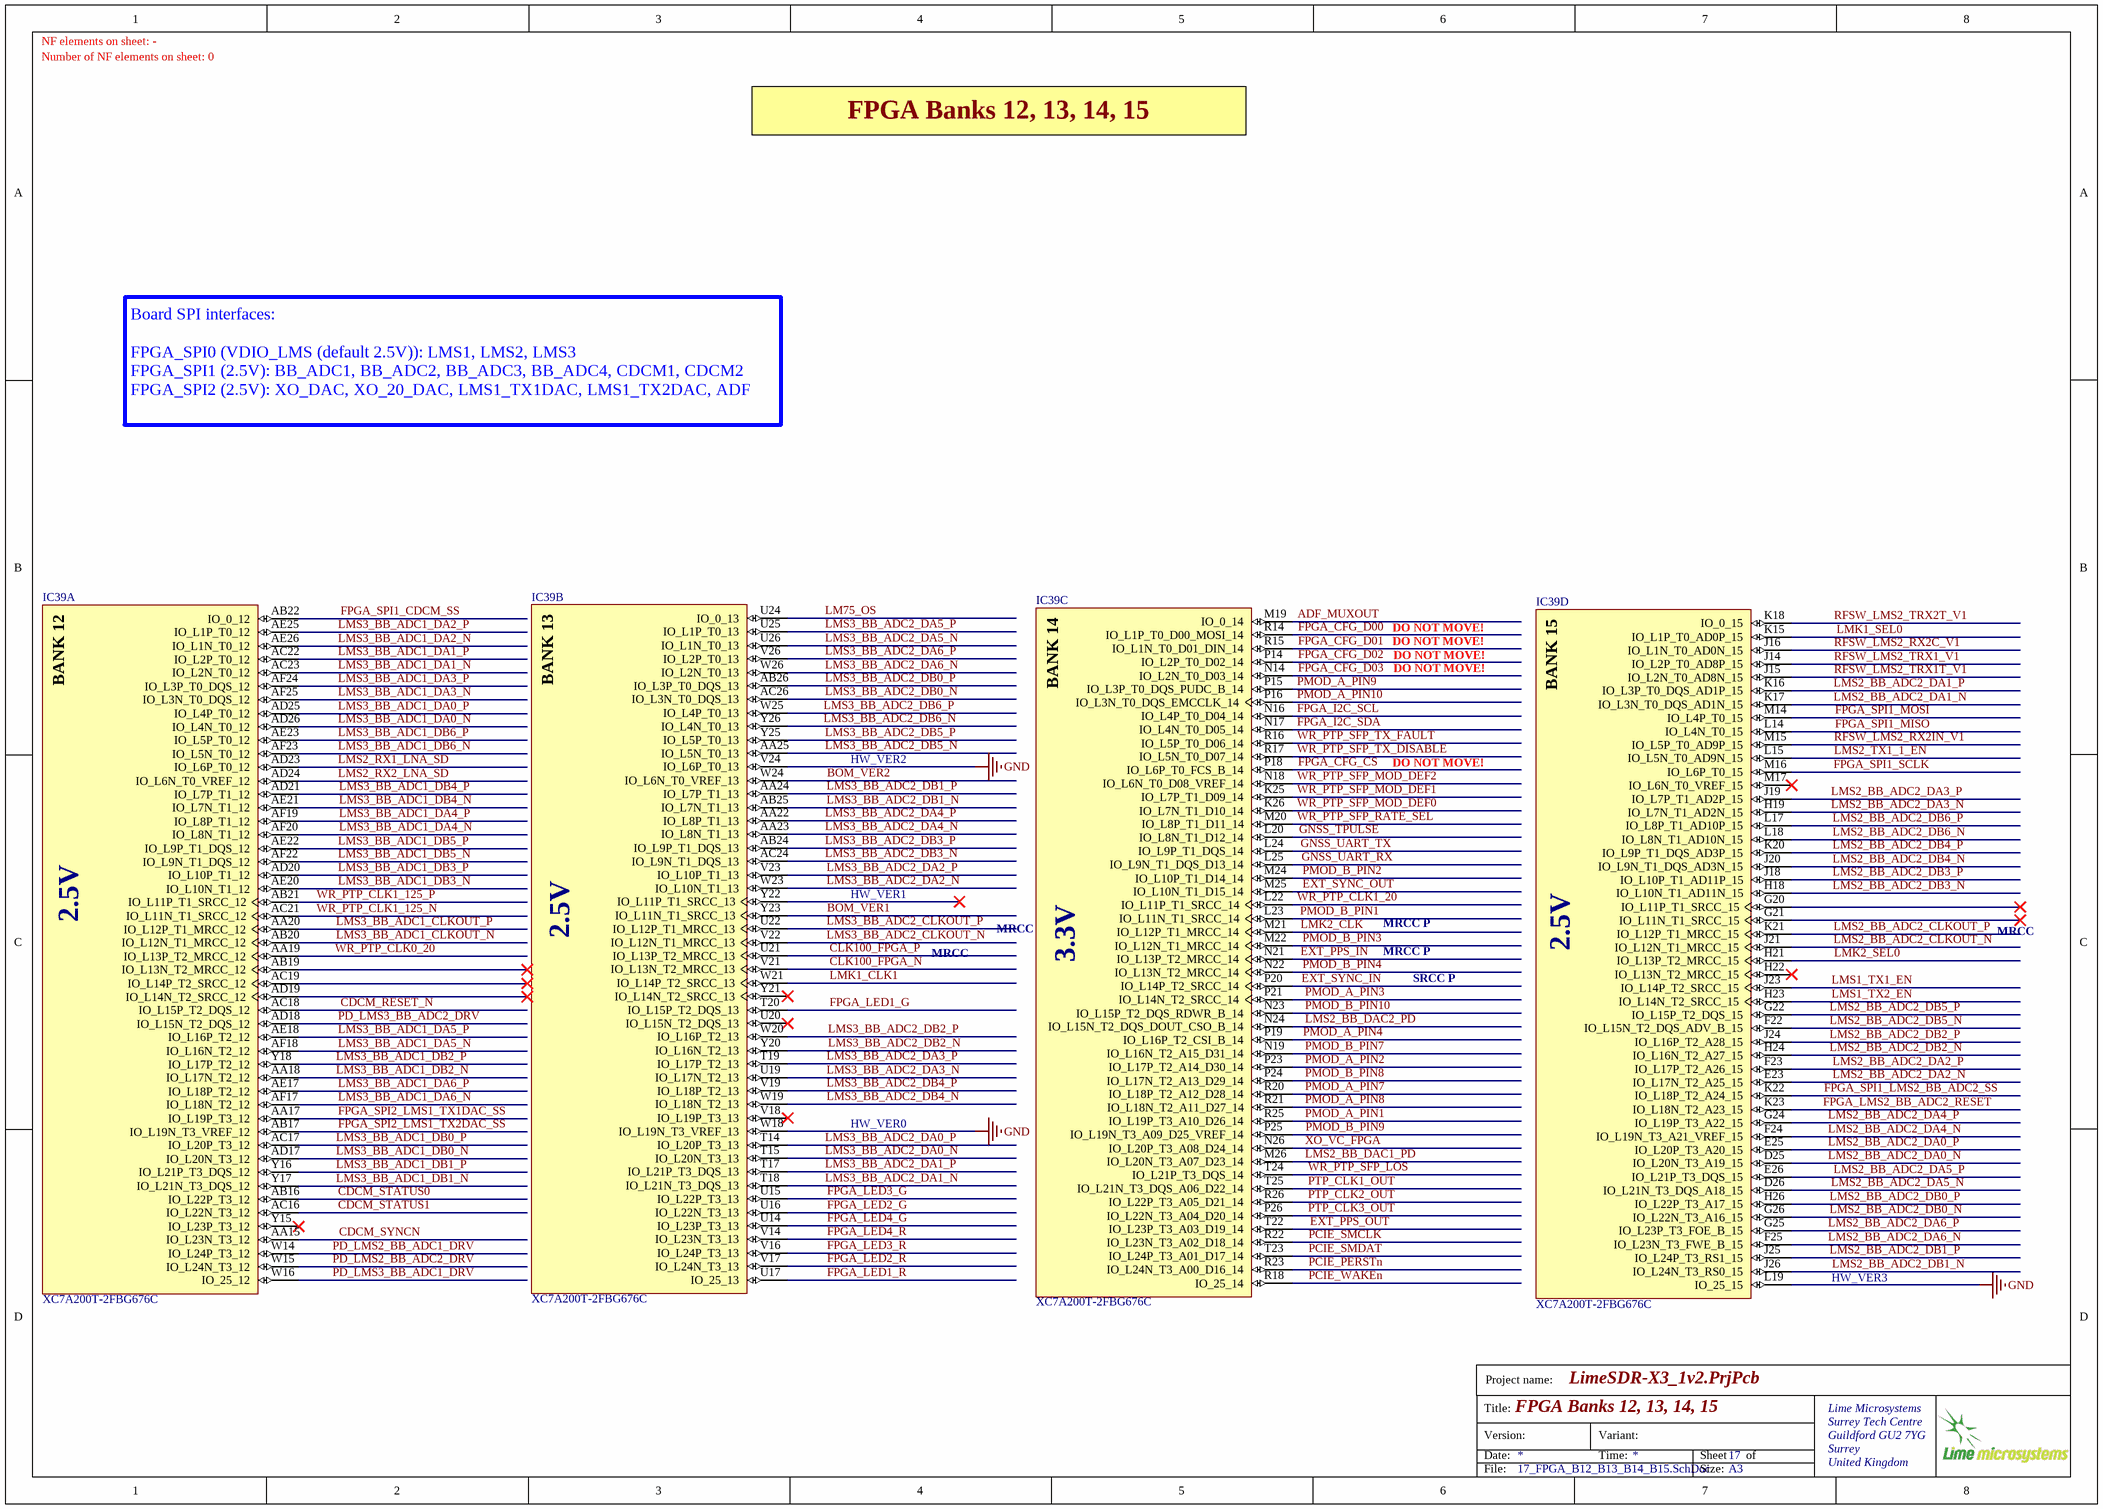
[diagram p16: 17_FPGA_B12_B13_B14_B15.SchDoc]

### Parts
IC39  XC7A200T-2FBG676C  [XC7A200T-2FBG676C_FBG676]  (parts A,B,C,D of 14)

### Nets
GND: IC39.L19(IO_25_15) IC39.V24(IO_L6P_T0_13) IC39.W18(IO_L19N_T3_VREF_13)
ADF_MUXOUT: IC39.M19(IO_0_14)
BOM_VER1: IC39.Y23(IO_L11N_T1_SRCC_13)
BOM_VER2: IC39.W24(IO_L6N_T0_VREF_13)
CDCM_RESET_N: IC39.AC18(IO_L15P_T2_DQS_12)
CDCM_STATUS0: IC39.AB16(IO_L22P_T3_12)
CDCM_STATUS1: IC39.AC16(IO_L22N_T3_12)
CDCM_SYNCN: IC39.AA15(IO_L23N_T3_12)
CLK100_FPGA_N: IC39.V21(IO_L13N_T2_MRCC_13)
CLK100_FPGA_P: IC39.U21(IO_L13P_T2_MRCC_13)
EXT_PPS_IN: IC39.N21(IO_L13P_T2_MRCC_14)
EXT_PPS_OUT: IC39.T22(IO_L23P_T3_A03_D19_14)
EXT_SYNC_IN: IC39.P20(IO_L14P_T2_SRCC_14)
EXT_SYNC_OUT: IC39.M25(IO_L10N_T1_D15_14)
FPGA_CFG_CS: IC39.P18(IO_L6P_T0_FCS_B_14)
FPGA_CFG_D00: IC39.R14(IO_L1P_T0_D00_MOSI_14)
FPGA_CFG_D01: IC39.R15(IO_L1N_T0_D01_DIN_14)
FPGA_CFG_D02: IC39.P14(IO_L2P_T0_D02_14)
FPGA_CFG_D03: IC39.N14(IO_L2N_T0_D03_14)
FPGA_I2C_SCL: IC39.N16(IO_L4P_T0_D04_14)
FPGA_I2C_SDA: IC39.N17(IO_L4N_T0_D05_14)
FPGA_LED1_G: IC39.T20(IO_L15P_T2_DQS_13)
FPGA_LED1_R: IC39.U17(IO_25_13)
FPGA_LED2_G: IC39.U16(IO_L22N_T3_13)
FPGA_LED2_R: IC39.V17(IO_L24N_T3_13)
FPGA_LED3_G: IC39.U15(IO_L22P_T3_13)
FPGA_LED3_R: IC39.V16(IO_L24P_T3_13)
FPGA_LED4_G: IC39.U14(IO_L23P_T3_13)
FPGA_LED4_R: IC39.V14(IO_L23N_T3_13)
FPGA_LMS2_BB_ADC2_RESET: IC39.K23(IO_L18N_T2_A23_15)
FPGA_SPI1_CDCM_SS: IC39.AB22(IO_0_12)
FPGA_SPI1_LMS2_BB_ADC2_SS: IC39.K22(IO_L18P_T2_A24_15)
FPGA_SPI1_MISO: IC39.L14(IO_L4N_T0_15)
FPGA_SPI1_MOSI: IC39.M14(IO_L4P_T0_15)
FPGA_SPI1_SCLK: IC39.M16(IO_L6P_T0_15)
FPGA_SPI2_LMS1_TX1DAC_SS: IC39.AA17(IO_L19P_T3_12)
FPGA_SPI2_LMS1_TX2DAC_SS: IC39.AB17(IO_L19N_T3_VREF_12)
GNSS_TPULSE: IC39.L20(IO_L8N_T1_D12_14)
GNSS_UART_RX: IC39.L25(IO_L9N_T1_DQS_D13_14)
GNSS_UART_TX: IC39.L24(IO_L9P_T1_DQS_14)
LM75_OS: IC39.U24(IO_0_13)
LMK1_CLK1: IC39.W21(IO_L14P_T2_SRCC_13)
LMK1_SEL0: IC39.K15(IO_L1P_T0_AD0P_15)
LMK2_CLK: IC39.M21(IO_L12P_T1_MRCC_14)
LMK2_SEL0: IC39.H21(IO_L13P_T2_MRCC_15)
LMS1_TX1_EN: IC39.J23(IO_L14P_T2_SRCC_15)
LMS1_TX2_EN: IC39.H23(IO_L14N_T2_SRCC_15)
LMS2_BB_ADC2_CLKOUT_N: IC39.J21(IO_L12N_T1_MRCC_15)
LMS2_BB_ADC2_CLKOUT_P: IC39.K21(IO_L12P_T1_MRCC_15)
LMS2_BB_ADC2_DA0_N: IC39.D25(IO_L20N_T3_A19_15)
LMS2_BB_ADC2_DA0_P: IC39.E25(IO_L20P_T3_A20_15)
LMS2_BB_ADC2_DA1_N: IC39.K17(IO_L3N_T0_DQS_AD1N_15)
LMS2_BB_ADC2_DA1_P: IC39.K16(IO_L3P_T0_DQS_AD1P_15)
LMS2_BB_ADC2_DA2_N: IC39.E23(IO_L17N_T2_A25_15)
LMS2_BB_ADC2_DA2_P: IC39.F23(IO_L17P_T2_A26_15)
LMS2_BB_ADC2_DA3_N: IC39.H19(IO_L7N_T1_AD2N_15)
LMS2_BB_ADC2_DA3_P: IC39.J19(IO_L7P_T1_AD2P_15)
LMS2_BB_ADC2_DA4_N: IC39.F24(IO_L19N_T3_A21_VREF_15)
LMS2_BB_ADC2_DA4_P: IC39.G24(IO_L19P_T3_A22_15)
LMS2_BB_ADC2_DA5_N: IC39.D26(IO_L21N_T3_DQS_A18_15)
LMS2_BB_ADC2_DA5_P: IC39.E26(IO_L21P_T3_DQS_15)
LMS2_BB_ADC2_DA6_N: IC39.F25(IO_L23N_T3_FWE_B_15)
LMS2_BB_ADC2_DA6_P: IC39.G25(IO_L23P_T3_FOE_B_15)
LMS2_BB_ADC2_DB0_N: IC39.G26(IO_L22N_T3_A16_15)
LMS2_BB_ADC2_DB0_P: IC39.H26(IO_L22P_T3_A17_15)
LMS2_BB_ADC2_DB1_N: IC39.J26(IO_L24N_T3_RS0_15)
LMS2_BB_ADC2_DB1_P: IC39.J25(IO_L24P_T3_RS1_15)
LMS2_BB_ADC2_DB2_N: IC39.H24(IO_L16N_T2_A27_15)
LMS2_BB_ADC2_DB2_P: IC39.J24(IO_L16P_T2_A28_15)
LMS2_BB_ADC2_DB3_N: IC39.H18(IO_L10N_T1_AD11N_15)
LMS2_BB_ADC2_DB3_P: IC39.J18(IO_L10P_T1_AD11P_15)
LMS2_BB_ADC2_DB4_N: IC39.J20(IO_L9N_T1_DQS_AD3N_15)
LMS2_BB_ADC2_DB4_P: IC39.K20(IO_L9P_T1_DQS_AD3P_15)
LMS2_BB_ADC2_DB5_N: IC39.F22(IO_L15N_T2_DQS_ADV_B_15)
LMS2_BB_ADC2_DB5_P: IC39.G22(IO_L15P_T2_DQS_15)
LMS2_BB_ADC2_DB6_N: IC39.L18(IO_L8N_T1_AD10N_15)
LMS2_BB_ADC2_DB6_P: IC39.L17(IO_L8P_T1_AD10P_15)
LMS2_BB_DAC1_PD: IC39.M26(IO_L20N_T3_A07_D23_14)
LMS2_BB_DAC2_PD: IC39.N24(IO_L15N_T2_DQS_DOUT_CSO_B_14)
LMS2_RX1_LNA_SD: IC39.AD23(IO_L6P_T0_12)
LMS2_RX2_LNA_SD: IC39.AD24(IO_L6N_T0_VREF_12)
LMS2_TX1_1_EN: IC39.L15(IO_L5N_T0_AD9N_15)
LMS3_BB_ADC1_CLKOUT_N: IC39.AB20(IO_L12N_T1_MRCC_12)
LMS3_BB_ADC1_CLKOUT_P: IC39.AA20(IO_L12P_T1_MRCC_12)
LMS3_BB_ADC1_DA0_N: IC39.AD26(IO_L4N_T0_12)
LMS3_BB_ADC1_DA0_P: IC39.AD25(IO_L4P_T0_12)
LMS3_BB_ADC1_DA1_N: IC39.AC23(IO_L2N_T0_12)
LMS3_BB_ADC1_DA1_P: IC39.AC22(IO_L2P_T0_12)
LMS3_BB_ADC1_DA2_N: IC39.AE26(IO_L1N_T0_12)
LMS3_BB_ADC1_DA2_P: IC39.AE25(IO_L1P_T0_12)
LMS3_BB_ADC1_DA3_N: IC39.AF25(IO_L3N_T0_DQS_12)
LMS3_BB_ADC1_DA3_P: IC39.AF24(IO_L3P_T0_DQS_12)
LMS3_BB_ADC1_DA4_N: IC39.AF20(IO_L8N_T1_12)
LMS3_BB_ADC1_DA4_P: IC39.AF19(IO_L8P_T1_12)
LMS3_BB_ADC1_DA5_N: IC39.AF18(IO_L16N_T2_12)
LMS3_BB_ADC1_DA5_P: IC39.AE18(IO_L16P_T2_12)
LMS3_BB_ADC1_DA6_N: IC39.AF17(IO_L18N_T2_12)
LMS3_BB_ADC1_DA6_P: IC39.AE17(IO_L18P_T2_12)
LMS3_BB_ADC1_DB0_N: IC39.AD17(IO_L20N_T3_12)
LMS3_BB_ADC1_DB0_P: IC39.AC17(IO_L20P_T3_12)
LMS3_BB_ADC1_DB1_N: IC39.Y17(IO_L21N_T3_DQS_12)
LMS3_BB_ADC1_DB1_P: IC39.Y16(IO_L21P_T3_DQS_12)
LMS3_BB_ADC1_DB2_N: IC39.AA18(IO_L17N_T2_12)
LMS3_BB_ADC1_DB2_P: IC39.Y18(IO_L17P_T2_12)
LMS3_BB_ADC1_DB3_N: IC39.AE20(IO_L10N_T1_12)
LMS3_BB_ADC1_DB3_P: IC39.AD20(IO_L10P_T1_12)
LMS3_BB_ADC1_DB4_N: IC39.AE21(IO_L7N_T1_12)
LMS3_BB_ADC1_DB4_P: IC39.AD21(IO_L7P_T1_12)
LMS3_BB_ADC1_DB5_N: IC39.AF22(IO_L9N_T1_DQS_12)
LMS3_BB_ADC1_DB5_P: IC39.AE22(IO_L9P_T1_DQS_12)
LMS3_BB_ADC1_DB6_N: IC39.AF23(IO_L5N_T0_12)
LMS3_BB_ADC1_DB6_P: IC39.AE23(IO_L5P_T0_12)
LMS3_BB_ADC2_CLKOUT_N: IC39.V22(IO_L12N_T1_MRCC_13)
LMS3_BB_ADC2_CLKOUT_P: IC39.U22(IO_L12P_T1_MRCC_13)
LMS3_BB_ADC2_DA0_N: IC39.T15(IO_L20N_T3_13)
LMS3_BB_ADC2_DA0_P: IC39.T14(IO_L20P_T3_13)
LMS3_BB_ADC2_DA1_N: IC39.T18(IO_L21N_T3_DQS_13)
LMS3_BB_ADC2_DA1_P: IC39.T17(IO_L21P_T3_DQS_13)
LMS3_BB_ADC2_DA2_N: IC39.W23(IO_L10N_T1_13)
LMS3_BB_ADC2_DA2_P: IC39.V23(IO_L10P_T1_13)
LMS3_BB_ADC2_DA3_N: IC39.U19(IO_L17N_T2_13)
LMS3_BB_ADC2_DA3_P: IC39.T19(IO_L17P_T2_13)
LMS3_BB_ADC2_DA4_N: IC39.AA23(IO_L8N_T1_13)
LMS3_BB_ADC2_DA4_P: IC39.AA22(IO_L8P_T1_13)
LMS3_BB_ADC2_DA5_N: IC39.U26(IO_L1N_T0_13)
LMS3_BB_ADC2_DA5_P: IC39.U25(IO_L1P_T0_13)
LMS3_BB_ADC2_DA6_N: IC39.W26(IO_L2N_T0_13)
LMS3_BB_ADC2_DA6_P: IC39.V26(IO_L2P_T0_13)
LMS3_BB_ADC2_DB0_N: IC39.AC26(IO_L3N_T0_DQS_13)
LMS3_BB_ADC2_DB0_P: IC39.AB26(IO_L3P_T0_DQS_13)
LMS3_BB_ADC2_DB1_N: IC39.AB25(IO_L7N_T1_13)
LMS3_BB_ADC2_DB1_P: IC39.AA24(IO_L7P_T1_13)
LMS3_BB_ADC2_DB2_N: IC39.Y20(IO_L16N_T2_13)
LMS3_BB_ADC2_DB2_P: IC39.W20(IO_L16P_T2_13)
LMS3_BB_ADC2_DB3_N: IC39.AC24(IO_L9N_T1_DQS_13)
LMS3_BB_ADC2_DB3_P: IC39.AB24(IO_L9P_T1_DQS_13)
LMS3_BB_ADC2_DB4_N: IC39.W19(IO_L18N_T2_13)
LMS3_BB_ADC2_DB4_P: IC39.V19(IO_L18P_T2_13)
LMS3_BB_ADC2_DB5_N: IC39.AA25(IO_L5N_T0_13)
LMS3_BB_ADC2_DB5_P: IC39.Y25(IO_L5P_T0_13)
LMS3_BB_ADC2_DB6_N: IC39.Y26(IO_L4N_T0_13)
LMS3_BB_ADC2_DB6_P: IC39.W25(IO_L4P_T0_13)
PCIE_PERSTn: IC39.R23(IO_L24N_T3_A00_D16_14)
PCIE_SMCLK: IC39.R22(IO_L23N_T3_A02_D18_14)
PCIE_SMDAT: IC39.T23(IO_L24P_T3_A01_D17_14)
PCIE_WAKEn: IC39.R18(IO_25_14)
PD_LMS2_BB_ADC1_DRV: IC39.W14(IO_L24P_T3_12)
PD_LMS2_BB_ADC2_DRV: IC39.W15(IO_L24N_T3_12)
PD_LMS3_BB_ADC1_DRV: IC39.W16(IO_25_12)
PD_LMS3_BB_ADC2_DRV: IC39.AD18(IO_L15N_T2_DQS_12)
PMOD_A_PIN1: IC39.R25(IO_L19P_T3_A10_D26_14)
PMOD_A_PIN2: IC39.P23(IO_L17P_T2_A14_D30_14)
PMOD_A_PIN3: IC39.P21(IO_L14N_T2_SRCC_14)
PMOD_A_PIN4: IC39.P19(IO_L16P_T2_CSI_B_14)
PMOD_A_PIN7: IC39.R20(IO_L18P_T2_A12_D28_14)
PMOD_A_PIN8: IC39.R21(IO_L18N_T2_A11_D27_14)
PMOD_A_PIN9: IC39.P15(IO_L3P_T0_DQS_PUDC_B_14)
PMOD_A_PIN10: IC39.P16(IO_L3N_T0_DQS_EMCCLK_14)
PMOD_B_PIN1: IC39.L23(IO_L11N_T1_SRCC_14)
PMOD_B_PIN2: IC39.M24(IO_L10P_T1_D14_14)
PMOD_B_PIN3: IC39.M22(IO_L12N_T1_MRCC_14)
PMOD_B_PIN4: IC39.N22(IO_L13N_T2_MRCC_14)
PMOD_B_PIN7: IC39.N19(IO_L16N_T2_A15_D31_14)
PMOD_B_PIN8: IC39.P24(IO_L17N_T2_A13_D29_14)
PMOD_B_PIN9: IC39.P25(IO_L19N_T3_A09_D25_VREF_14)
PMOD_B_PIN10: IC39.N23(IO_L15P_T2_DQS_RDWR_B_14)
PTP_CLK1_OUT: IC39.T25(IO_L21N_T3_DQS_A06_D22_14)
PTP_CLK2_OUT: IC39.R26(IO_L22P_T3_A05_D21_14)
PTP_CLK3_OUT: IC39.P26(IO_L22N_T3_A04_D20_14)
RFSW_LMS2_RX2C_V1: IC39.J16(IO_L1N_T0_AD0N_15)
RFSW_LMS2_RX2IN_V1: IC39.M15(IO_L5P_T0_AD9P_15)
RFSW_LMS2_TRX1_V1: IC39.J14(IO_L2P_T0_AD8P_15)
RFSW_LMS2_TRX1T_V1: IC39.J15(IO_L2N_T0_AD8N_15)
RFSW_LMS2_TRX2T_V1: IC39.K18(IO_0_15)
WR_PTP_CLK0_20: IC39.AA19(IO_L13P_T2_MRCC_12)
WR_PTP_CLK1_20: IC39.L22(IO_L11P_T1_SRCC_14)
WR_PTP_CLK1_125_N: IC39.AC21(IO_L11N_T1_SRCC_12)
WR_PTP_CLK1_125_P: IC39.AB21(IO_L11P_T1_SRCC_12)
WR_PTP_SFP_LOS: IC39.T24(IO_L21P_T3_DQS_14)
WR_PTP_SFP_MOD_DEF0: IC39.K26(IO_L7N_T1_D10_14)
WR_PTP_SFP_MOD_DEF1: IC39.K25(IO_L7P_T1_D09_14)
WR_PTP_SFP_MOD_DEF2: IC39.N18(IO_L6N_T0_D08_VREF_14)
WR_PTP_SFP_RATE_SEL: IC39.M20(IO_L8P_T1_D11_14)
WR_PTP_SFP_TX_DISABLE: IC39.R17(IO_L5N_T0_D07_14)
WR_PTP_SFP_TX_FAULT: IC39.R16(IO_L5P_T0_D06_14)
XO_VC_FPGA: IC39.N26(IO_L20P_T3_A08_D24_14)

Not connected (* = marked no-connect by the designer): IC39 AB19(IO_L13N_T2_MRCC_12)* AC19(IO_L14P_T2_SRCC_12)* AD19(IO_L14N_T2_SRCC_12)* G20(IO_L11P_T1_SRCC_15)* G21(IO_L11N_T1_SRCC_15)* H22(IO_L13N_T2_MRCC_15)* M17(IO_L6N_T0_VREF_15)* U20(IO_L15N_T2_DQS_13)* V18(IO_L19P_T3_13)* Y15(IO_L23P_T3_12)* Y21(IO_L14N_T2_SRCC_13)* Y22(IO_L11P_T1_SRCC_13)*

### Notes on the sheet
- NF elements on sheet: -
- Number of NF elements on sheet: 0
- FPGA Banks 12, 13, 14, 15
- Board SPI interfaces:
  FPGA_SPI0 (VDIO_LMS (default 2.5V)): LMS1, LMS2, LMS3
  FPGA_SPI1 (2.5V): BB_ADC1, BB_ADC2, BB_ADC3, BB_ADC4, CDCM1, CDCM2
  FPGA_SPI2 (2.5V): XO_DAC, XO_20_DAC, LMS1_TX1DAC, LMS1_TX2DAC, ADF
- DO NOT MOVE!
- HW_VER2
- 2.5V
- HW_VER1
- MRCC
- 3.3V
- MRCC P
- SRCC P
- HW_VER0
- HW_VER3
- Project name:
- Title:
- Version:
- Date:
- Variant:
- Time:
- Sheet
- of
- File:
- Size:
- A3
- (in symbol XC7A200T-2FBG676C, part A) BANK 12
- (in symbol XC7A200T-2FBG676C, part B) BANK 13
- (in symbol XC7A200T-2FBG676C, part C) BANK 14
- (in symbol XC7A200T-2FBG676C, part D) BANK 15

### Library data of the parts
IC39 = XC7A200T-2FBG676C: Artix-7 FPGA, 400 User I/Os, 8 GTP, 676-Ball BGA, Speed Grade 2, Commercial Grade, Pb-Free; Manufacturer: Xilinx; Part Description: IC FPGA 400 I/O 676FCBGA; Speed Grade: -2; Number of Logic Blocks (LABs): 16825; Number of Logic Elements/Cells: 215360; RAM Size: 13455360b; Number of I/Os: 400; Number of Registers: 269200; Memory Type: DDR3; Memory Size: 1GB; Max Supply Voltage: 1.05V; Min Supply Voltage: 950mV; ComponentLink1Description: Manufacturer URL; ComponentLink1URL: http://www.xilinx.com/; ComponentLink2Description: Datasheet; ComponentLink2URL: http://www.xilinx.com/support/documentation/data_sheets/ds180_7Series_Overview.pdf; ComponentLink3Description: Package Specification; ComponentLink3URL: http://www.xilinx.com/support/documentation/user_guides/ug475_7Series_Pkg_Pinout.pdf; ComponentLink4Description: DC and Switching Characteristics; ComponentLink4URL: http://www.xilinx.com/support/documentation/data_sheets/ds181_Artix_7_Data_Sheet.pdf; ComponentLink5Description: Package File; ComponentLink5URL: http://www.xilinx.com/support/packagefiles/a7packages/xc7a200tfbg676pkg.txt; ComponentLink6Description: Packaging and Pinout; ComponentLink6URL: http://www.xilinx.com/support/documentation/user_guides/ug475_7Series_Pkg_Pinout.pdf; Supplier 1: Digi-Key; Supplier Part Number 1: 122-1865-ND; Manufacturer Part Number 1: XC7A200T-2FBG676C; Stock 1: 124; Pricing 1: 1=261,30000 (USD); RoHS: Yes; Case/Package: FCBGA; Number of Pins: 676; Contact Plating: Copper,Tin,Silver; Min Operating Temperature: 0°C; Max Operating Temperature: 85°C; ComponentLink7URL: https://datasheet.ciiva.com/15066/ds181-artix-7-data-sheet-15066344.pdf?src-supplier=Digi-Key; ComponentLink7Description: https://datasheet.ciiva.com/15066/ds181-artix-7-data-sheet-15066344.pdf?src-supplier=Digi-Key; ComponentLink8URL: https://datasheet.ciiva.com/48475/ds180-7series-overview-48475947.pdf?src-supplier=Avnet; ComponentLink8Description: https://datasheet.ciiva.com/48475/ds180-7series-overview-48475947.pdf?src-supplier=Avnet